# Altium project UNOshield.PrjPcb (part 1 of 2)
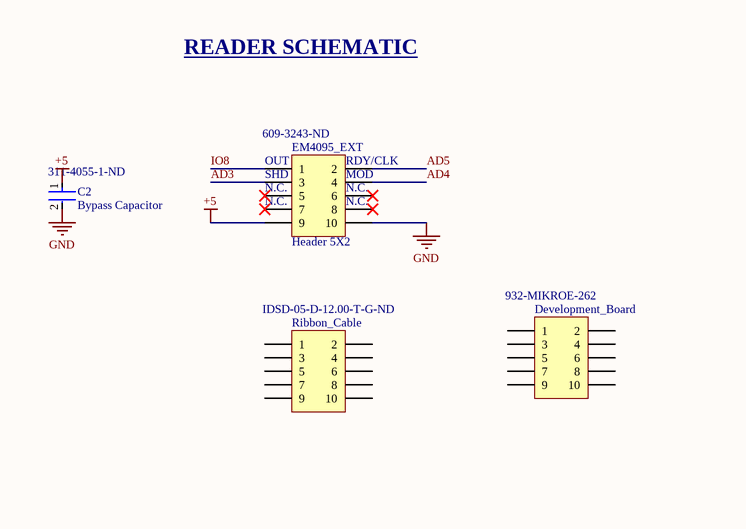
[diagram p0: EM4095.SchDoc, left]
6 sheets, 37 parts. Net scope: global (net labels, ports and power ports of the same name join across sheets).
Board files: UNOshield.PcbDoc, RFID_Panel.PcbDoc
Sheets:
  EM4095.SchDoc
  MAX490.SchDoc
  UNOshield.SchDoc
  Door_Actuator.SchDoc
  Buzzer.SchDoc
  LCD.SchDoc

## Sheet EM4095.SchDoc
size A

### Parts
C2  Bypass Capacitor  Supplier Part Number 1: 311-4055-1-ND  [FP-CC0603-DA-MFG]
Development_Board  Supplier Part Number 1: 932-MIKROE-262  [HDR2X5]  (mechanical)
EM4095_EXT  Header 5X2  Supplier Part Number 1: 609-3243-ND  [HDR2X5]
Ribbon_Cable  Supplier Part Number 1: IDSD-05-D-12.00-T-G-ND  [HDR2X5]  (mechanical)

### Nets
+5: C2.1 EM4095_EXT.9  [project net 5V]
GND: C2.2 EM4095_EXT.10
AD3: EM4095_EXT.3
AD4: EM4095_EXT.4
AD5: EM4095_EXT.2
IO8: EM4095_EXT.1

Not connected (* = marked no-connect by the designer): Development_Board 1 2 3 4 5 6 7 8 9 10; EM4095_EXT 5* 6* 7* 8*; Ribbon_Cable 1 2 3 4 5 6 7 8 9 10

### Notes on the sheet
- READER SCHEMATIC
- (near EM4095_EXT) OUT
- (near EM4095_EXT) SHD
- (near EM4095_EXT) RDY/CLK
- (near EM4095_EXT) MOD
- (near EM4095_EXT) N.C.

### Library data of the parts
C2 = CMP-03422-001228-1: CAP CER 0.1UF 10V X7R 0603; Manufacturer Part Number: CC0603KRX7R6BB104; Manufacturer: YAGEO; Material: Ceramic; Tolerance: 0.1; Capacitance: 100 nF; Temperature Coefficient: 15%; Value: 100 nF; Multilayer: Yes; Tolerance  (fill in as +-): 10%; Height: 0.9mm; RoHS: TRUE; Footprint Url: http://www.yageo.com/exep/pages/download/literatures/UPY-C_GEN_24.pdf; Octopart: https://octopart.com/cc0603krx7r6bb104-yageo-9291607; Device Class L1: Passive Components; Mouser Description: 0603 0.1 uF 10 V ±10 % Tolerance X7R SMT Multilayer Ceramic Capacitor; ComponentLink2URL: http://www.yageo.com/documents/recent/UPY-GPHC_X7R_6.3V-to-50V_18.pdf; Automotive: No; Voltage: 10 V; Device Class L3: Ceramic Capacitors; Category: Cap; Temperature: -55°C to +125°C; ComponentLink2Description: Datasheet; Voltage Rating: 10 V; Device Class L2: Capacitors; Lead Free: Yes; Temperature Range High: +125°C; Temperature Range Low: -55°C; Digikey Description: CAP CER 0.1UF 10V X7R 0603; Package: CC0603-DA; Temperature Characteristic: X7R; Supplier 1: Digikey; Stock 1: 58484; Pricing 1: 1=0.1, 10=0.055, 100=0.0327, 1000=0.02132 (USD); Mounting Technology: Surface Mount; Pins: 2; Dielectric Material: Ceramic; Package Shape: Rectangular; Case/Package: 0603; Terminal Finish: Nickel; Min Operating Temperature: -55°C; Max Operating Temperature: 125°C; JESD-609 Code: e3; Capacitor Type: Ceramic; Package Style: SMTMeter; Packaging: Tape and Reel; Tolerance (fill in as +-): 10%; Rated DC Voltage (URdc): 10V; Temperature Characteristics Code: X7R; Termination: Wraparound; Length: 1.6mm; Width: 0.8mm; Reach SVHC Compliant: Yes; RoHS Compliant: Yes; ComponentLink1URL: https://datasheet.ciiva.com:443/pdfs/VipMasterIC/IC/YAGO/YAGO-S-A0003557223/YAGO-S-A0003557223-1.pdf?src-supplier=IHS+Markit; ComponentLink1Description: https://datasheet.ciiva.com:443/pdfs/VipMasterIC/IC/YAGO/YAGO-S-A0003557223/YAGO-S-A0003557223-1.pdf?src-supplier=IHS+Markit; ComponentLink3URL: https://datasheet.ciiva.com/11586/upy-gphc-x7r-6-3v-to-50v-8-11586327.pdf?src-supplier=Avnet; ComponentLink3Description: https://datasheet.ciiva.com/11586/upy-gphc-x7r-6-3v-to-50v-8-11586327.pdf?src-supplier=Avnet
Development_Board = Header 5X2: EM4095 NFC/RFID Reader and Writer Development Board; Manufacturer: mikroElektronika; Manufacturer Part Number: MIKROE-262; Supplier 1: Mouser; RoHS: Yes; Category: Embedded Processors and Controllers; Stock 1: 16; Pricing 1: 1=29, 10=29, 50=29, 100=29, 1000=29, 10000=29 (USD); ComponentLink1URL: https://datasheet.ciiva.com/4712/rfid-manual-v100-31329-4712706.pdf?src-supplier=Mouser; ComponentLink1Description: https://datasheet.ciiva.com/4712/rfid-manual-v100-31329-4712706.pdf?src-supplier=Mouser; ComponentLink2URL: https://datasheet.ciiva.com/29616/rfid-manual-v100-29616555.pdf?src-supplier=Digikey; ComponentLink2Description: https://datasheet.ciiva.com/29616/rfid-manual-v100-29616555.pdf?src-supplier=Digikey
EM4095_EXT = Header 5X2: Board Connector, 66 Contact(s), 2 Row(s), Male, Straight, Solder Terminal; Manufacturer: Amphenol Communications Solutions; Manufacturer Part Number: 67997410HLF; LatestRevisionDate: 17-Jul-2002; LatestRevisionNote: Re-released for DXP Platform.; Publisher: Altium Limited; Supplier 1: Digikey; RoHS: No; Stock 1: 5769; Pricing 1: 1=0.3, 10=0.255, 400=0.19665, 800=0.18725, 1200=0.18197, 5200=0.16407, 10000=0.15667 (USD); ComponentLink1URL: https://datasheet.octopart.com/67997-410HLF-Amphenol-Communications-Solutions-datasheet-10288749.pdf?src-supplier=Farnell; ComponentLink1Description: https://datasheet.octopart.com/67997-410HLF-Amphenol-Communications-Solutions-datasheet-10288749.pdf?src-supplier=Farnell; ComponentLink2URL: https://datasheet.octopart.com/67997-410HLF-Areva-datasheet-15888151.pdf?src-supplier=Element14; ComponentLink2Description: https://datasheet.octopart.com/67997-410HLF-Areva-datasheet-15888151.pdf?src-supplier=Element14; ComponentLink3URL: https://datasheet.octopart.com/67997-410HLF-Amphenol-Communications-Solutions-datasheet-36854132.pdf?src-supplier=Electro+Sonic; ComponentLink3Description: https://datasheet.octopart.com/67997-410HLF-Amphenol-Communications-Solutions-datasheet-36854132.pdf?src-supplier=Electro+Sonic
Ribbon_Cable = Header 5X2: Cable Assembly, 28AWG; Manufacturer: Samtec; Manufacturer Part Number: IDSD-05-D-12.00-T-G; Supplier 1: Digikey; RoHS: Yes; Category: Cables and Wire; Stock 1: 125; Pricing 1: 1=6.19, 25=5.59, 50=5.2, 100=4.95, 500=4.05, 1000=3.75, 2500=3.6 (USD); Connector Support Type: CABLE ASSEMBLY; Reach SVHC Compliant: Yes; RoHS Compliant: Yes; ComponentLink1URL: https://datasheet.ciiva.com:443/pdfs/VipMasterIC/IC/SAMI/SAMI-S-A0008033238/SAMI-S-A0008033238-1.pdf?src-supplier=IHS+Markit; ComponentLink1Description: https://datasheet.ciiva.com:443/pdfs/VipMasterIC/IC/SAMI/SAMI-S-A0008033238/SAMI-S-A0008033238-1.pdf?src-supplier=IHS+Markit; ComponentLink2URL: ftp://ftp.samtec.com/webfiles/PDF/IDSS.PDF?src-supplier=Avnet; ComponentLink2Description: ftp://ftp.samtec.com/webfiles/PDF/IDSS.PDF?src-supplier=Avnet

## Sheet MAX490.SchDoc
size A
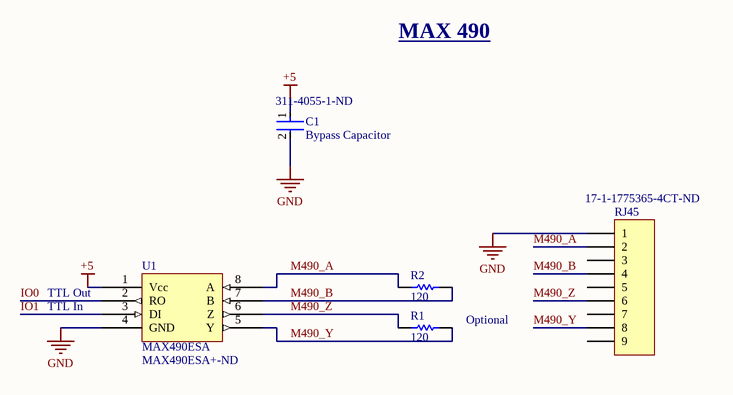
[diagram p1: MAX490.SchDoc]

### Parts
C1  Bypass Capacitor  Supplier Part Number 1: 311-4055-1-ND  [FP-CC0603-DA-MFG]
R1  Optional  value 120  [1608[0603]]
R2  value 120  [1608[0603]]
RJ45  Supplier Part Number 1: 17-1-1775365-4CT-ND  [1-1775365-4]
U1  MAX490ESA  Supplier Part Number 1: MAX490ESA+-ND  [SO-8_L]

### Nets
+5: C1.1 U1.1(Vcc)  [project net 5V]
GND: C1.2 RJ45.1 U1.4(GND)
IO0: U1.2(RO)
IO1: U1.3(DI)
M490_A: R2.2 RJ45.2 U1.8(A)
M490_B: R2.1 RJ45.4 U1.7(B)
M490_Y: R1.1 RJ45.8 U1.5(Y)
M490_Z: R1.2 RJ45.6 U1.6(Z)

Not connected (* = marked no-connect by the designer): RJ45 3 5 7 9

### Notes on the sheet
- MAX 490
- TTL In
- (near U1) TTL Out

### Library data of the parts
C1 = CMP-03422-001228-1: as C2 on sheet EM4095; Height: 0.9mm; RoHS: TRUE; Footprint Url: http://www.yageo.com/exep/pages/download/literatures/UPY-C_GEN_24.pdf; Octopart: https://octopart.com/cc0603krx7r6bb104-yageo-9291607; Device Class L1: Passive Components; Mouser Description: 0603 0.1 uF 10 V ±10 % Tolerance X7R SMT Multilayer Ceramic Capacitor; ComponentLink2URL: http://www.yageo.com/documents/recent/UPY-GPHC_X7R_6.3V-to-50V_18.pdf; Automotive: No; Voltage: 10 V; Device Class L3: Ceramic Capacitors; Category: Cap; Temperature: -55°C to +125°C; ComponentLink2Description: Datasheet; Voltage Rating: 10 V; Device Class L2: Capacitors; Lead Free: Yes; Temperature Range High: +125°C; Temperature Range Low: -55°C; Digikey Description: CAP CER 0.1UF 10V X7R 0603; Package: CC0603-DA; Temperature Characteristic: X7R; Supplier 1: Digikey; Stock 1: 58484; Pricing 1: 1=0.1, 10=0.055, 100=0.0327, 1000=0.02132 (USD); Mounting Technology: Surface Mount; Pins: 2; Dielectric Material: Ceramic; Package Shape: Rectangular; Case/Package: 0603; Terminal Finish: Nickel; Min Operating Temperature: -55°C; Max Operating Temperature: 125°C; JESD-609 Code: e3; Capacitor Type: Ceramic; Package Style: SMTMeter; Packaging: Tape and Reel; Tolerance (fill in as +-): 10%; Rated DC Voltage (URdc): 10V; Temperature Characteristics Code: X7R; Termination: Wraparound; Length: 1.6mm; Width: 0.8mm; Reach SVHC Compliant: Yes; RoHS Compliant: Yes; ComponentLink1URL: https://datasheet.ciiva.com:443/pdfs/VipMasterIC/IC/YAGO/YAGO-S-A0003557223/YAGO-S-A0003557223-1.pdf?src-supplier=IHS+Markit; ComponentLink1Description: https://datasheet.ciiva.com:443/pdfs/VipMasterIC/IC/YAGO/YAGO-S-A0003557223/YAGO-S-A0003557223-1.pdf?src-supplier=IHS+Markit; ComponentLink3URL: https://datasheet.ciiva.com/11586/upy-gphc-x7r-6-3v-to-50v-8-11586327.pdf?src-supplier=Avnet; ComponentLink3Description: https://datasheet.ciiva.com/11586/upy-gphc-x7r-6-3v-to-50v-8-11586327.pdf?src-supplier=Avnet
R1 R2 = Res1: SMD Chip Resistor, 120 Ohm, ± 5%, 250 mW, 0603 [1608 Metric], Thick Film, Anti-Surge; Manufacturer: Panasonic; Manufacturer Part Number: ERJ-PA3J121V; Supplier 1: Digikey; Supplier Part Number 1: P120BZCT-ND; RoHS: Yes; Category: Chip SMD Resistors; Stock 1: 57610; Pricing 1: 1=0.12, 10=0.056, 50=0.0358, 100=0.0301, 500=0.02112, 1000=0.01854 (USD); ComponentLink1URL: https://industrial.panasonic.com/cdbs/www-data/pdf/RDO0000/AOA0000C331.pdf?src-supplier=Digikey; ComponentLink1Description: https://industrial.panasonic.com/cdbs/www-data/pdf/RDO0000/AOA0000C331.pdf?src-supplier=Digikey; ComponentLink2URL: https://industrial.panasonic.com/ww/system/files/data/download/catalog/id_fixed-resistors_e_1.pdf?src-supplier=Digikey; ComponentLink2Description: https://industrial.panasonic.com/ww/system/files/data/download/catalog/id_fixed-resistors_e_1.pdf?src-supplier=Digikey; ComponentLink3URL: https://datasheet.octopart.com/ERJ-PA3J121V-Panasonic-datasheet-62096642.pdf?src-supplier=Future+Electronics; ComponentLink3Description: https://datasheet.octopart.com/ERJ-PA3J121V-Panasonic-datasheet-62096642.pdf?src-supplier=Future+Electronics
RJ45 = Header 9: Telecom and Datacom Connector; Manufacturer: TE Connectivity AMP; Manufacturer Series: 1775365; Supplier 1: Digikey; Manufacturer Part Number: 1-1775365-4; RoHS: Yes; Category: Modular / Ethernet Connectors; Stock 1: 551; Pricing 1: 1=3.81, 10=3.241, 25=3.0376, 50=2.8924 (USD); Contact Finish - Mating: NOT SPECIFIED; Connector Type: TELECOM AND DATACOM CONNECTOR; Reach SVHC Compliant: Yes; RoHS Compliant: Yes; ComponentLink1URL: https://www.te.com:443/usa-en/product-1-1775365-4.html?src-supplier=IHS+Markit; ComponentLink1Description: https://www.te.com:443/usa-en/product-1-1775365-4.html?src-supplier=IHS+Markit; ComponentLink2URL: https://datasheet.octopart.com/1-1775365-4-TE-Connectivity-datasheet-175421283.pdf?src-supplier=Farnell; ComponentLink2Description: https://datasheet.octopart.com/1-1775365-4-TE-Connectivity-datasheet-175421283.pdf?src-supplier=Farnell; ComponentLink3URL: https://www.te.com/commerce/DocumentDelivery/DDEController?Action=srchrtrv&amp;DocNm=1775365&amp;DocType=Customer+Drawing&amp;DocLang=English&src-supplier=Digikey; ComponentLink3Description: https://www.te.com/commerce/DocumentDelivery/DDEController?Action=srchrtrv&amp;DocNm=1775365&amp;DocType=Customer+Drawing&amp;DocLang=English&src-supplier=Digikey; ComponentLink4URL: http://www.te.com/commerce/DocumentDelivery/DDEController?Action=srchrtrv&DocNm=1775365&DocType=Customer+Drawing&DocLang=English&src-supplier=Digikey; ComponentLink4Description: http://www.te.com/commerce/DocumentDelivery/DDEController?Action=srchrtrv&DocNm=1775365&DocType=Customer+Drawing&DocLang=English&src-supplier=Digikey; ComponentLink5URL: https://datasheet.octopart.com/1-1775365-4-TE-Connectivity-datasheet-175421283.pdf?src-supplier=Element14; ComponentLink5Description: https://datasheet.octopart.com/1-1775365-4-TE-Connectivity-datasheet-175421283.pdf?src-supplier=Element14
U1 = MAX490ESA: Line Transceiver, 1 Func, 1 Driver, 1 Rcvr, CMOS, PDSO8; Manufacturer: Maxim; Manufacturer Part Number: MAX490ESA+; Package Body Material: Plastic; Output Polarity: Complementary; Differential Output: Yes; Driver Number of Bits: 1; High Level Input Current-Max: 2uA; Input Characteristics: DIFFERENTIAL SCHMITT TRIGGER; Out Swing-Min: 1.5V; Output Characteristics: TOTEM-POLE; Output Low Current-Max: 4mA; Package Equivalence Code: SOP8,.25; Power Supplies: 5V; Receive Delay-Max: 150ns; Max Supply Current: 500uA; Max Supply Voltage: 5.25V; Min Supply Voltage: 4.75V; Transmit Delay-Max: 60ns; Qualification Status: Not Qualified; Supplier 1: Digikey; RoHS: Yes; Category: RS-232 / RS-422 / RS-485 Interface ICs; Stock 1: 736; Pricing 1: 1=6.18, 10=4.743, 25=4.3836, 100=3.9887, 300=3.76847, 500=3.68704, 1000=3.59368, 2500=3.4951 (USD); Case/Package: SOP; Pins: 8; Package Shape: Rectangular; Terminal Finish: Tin; Min Operating Temperature: -40°C; Max Operating Temperature: 85°C; JESD-609 Code: e3; Interface IC Type: LINE TRANSCEIVER; JESD-30 Code: R-PDSO-G8; Moisture Sensitivity Level: 1; Channels: 1; Package Style: SMALL OUTLINEMeter; Peak Reflow Temperature (Cel): 260°C; Receiver Number of Bits: 1; Nominal Supply Voltage: 5V; Surface Mount: Yes; Technology: CMOS; Terminal Form: Gull Wing; Terminal Position: DUAL; Length: 4.9mm; Width: 3.9mm; Height - Seated (Max): 1.75mm; Terminal Pitch: 1.27mm; Temperature Grade: INDUSTRIAL; Reach SVHC Compliant: Yes; RoHS Compliant: Yes; ComponentLink1URL: https://datasheet.ciiva.com:443/pdfs/VipMasterIC/IC/MAXM/MAXMS13366/MAXMS13366-1.pdf?src-supplier=IHS+Markit; ComponentLink1Description: https://datasheet.ciiva.com:443/pdfs/VipMasterIC/IC/MAXM/MAXMS13366/MAXMS13366-1.pdf?src-supplier=IHS+Markit; ComponentLink2URL: https://datasheet.ciiva.com/4786/max1487-max491-96074-4786046.pdf?src-supplier=Mouser; ComponentLink2Description: https://datasheet.ciiva.com/4786/max1487-max491-96074-4786046.pdf?src-supplier=Mouser; ComponentLink3URL: https://datasheet.ciiva.com/1713/max1487-max491-1713335.pdf?src-supplier=Digikey; ComponentLink3Description: https://datasheet.ciiva.com/1713/max1487-max491-1713335.pdf?src-supplier=Digikey; ComponentLink4URL: https://datasheet.ciiva.com/3028/max1487-max491-3028673.pdf?src-supplier=Avnet; ComponentLink4Description: https://datasheet.ciiva.com/3028/max1487-max491-3028673.pdf?src-supplier=Avnet

## Sheet UNOshield.SchDoc
size A4; SPICEModelCacheCSOAAMCO: <root> / <DocumentId>CSOAAMCO</DocumentId> / </root>
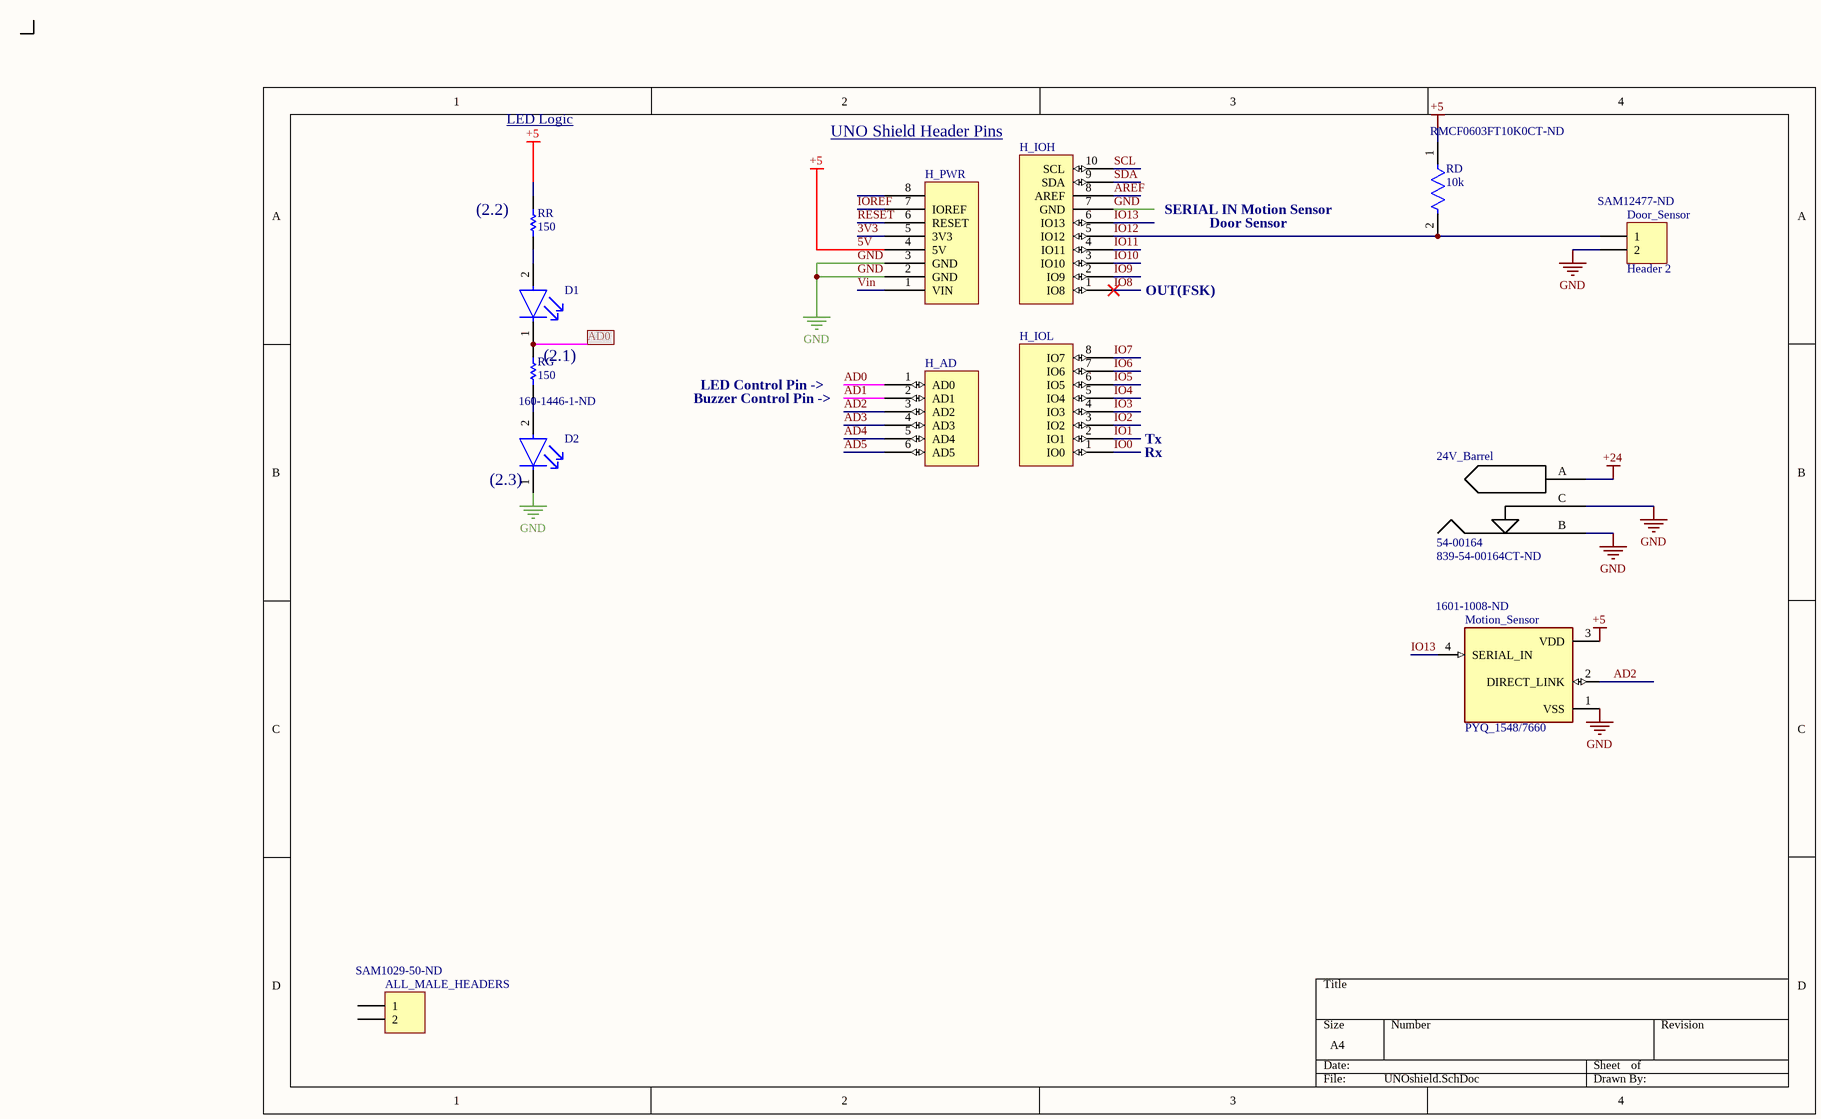
[diagram p2: UNOshield.SchDoc]

### Parts
24V_Barrel  54-00164  Supplier Part Number 1: 839-54-00164CT-ND  [54-00164]
ALL_MALE_HEADERS  Supplier Part Number 1: SAM1029-50-ND  [HDR1X2]  (mechanical)
D1  LS R976-NR-1  [FP-LS_R976-MFG]  (value not drawn)
D2  Supplier Part Number 1: 160-1446-1-ND  [FP-LTST-C191KGKT-MFG]  (hidden comment: LTST-C191KGKT)
Door_Sensor  Header 2  Supplier Part Number 1: SAM12477-ND  [HDR1X2]
H_AD  AD  [Header 6x1 8.5mm]  (value not drawn)
H_IOH  IOH  [Header 10x1 8.5mm]  (value not drawn)
H_IOL  IOL  [Header 8x1 8.5mm]  (value not drawn)
H_PWR  POWER_UNO  [Header 8x1 8.5mm]  (value not drawn)
Motion_Sensor  PYQ_1548/7660  Supplier Part Number 1: 1601-1008-ND  [TO254P940H440-4]
RD  10k  Supplier Part Number 1: RMCF0603FT10K0CT-ND  [FP-RC0603-0_55-IPC_C]
RG  value 150  [C0805]  (hidden comment: Res1)
RR  value 150  [C0805]  (hidden comment: Res1)

### Nets
5V: H_PWR.4(5V) Motion_Sensor.3(VDD) RD.1 RR.2  [also labelled +5]
+24: 24V_Barrel.A(Pin/Center)
GND: 24V_Barrel.B 24V_Barrel.C(Sheath/Outer) D2.1(C) Door_Sensor.2 H_IOH.7(GND) H_PWR.2(GND) H_PWR.3(GND) Motion_Sensor.1(VSS)
3V3: H_PWR.5(3V3)
AD0: D1.1(C) H_AD.1(AD0) RG.2
AD1: H_AD.2(AD1)
AD2: H_AD.3(AD2) Motion_Sensor.2(DIRECT_LINK)
AD3: H_AD.4(AD3)
AD4: H_AD.5(AD4)
AD5: H_AD.6(AD5)
AREF: H_IOH.8(AREF)
IO0: H_IOL.1(IO0)
IO1: H_IOL.2(IO1)
IO2: H_IOL.3(IO2)
IO3: H_IOL.4(IO3)
IO4: H_IOL.5(IO4)
IO5: H_IOL.6(IO5)
IO6: H_IOL.7(IO6)
IO7: H_IOL.8(IO7)
IO8: H_IOH.1(IO8)
IO9: H_IOH.2(IO9)
IO10: H_IOH.3(IO10)
IO11: H_IOH.4(IO11)
IO12: Door_Sensor.1 H_IOH.5(IO12) RD.2
IO13: H_IOH.6(IO13) Motion_Sensor.4(SERIAL_IN)
IOREF: H_PWR.7(IOREF)
RESET: H_PWR.6(RESET)
SCL: H_IOH.10(SCL)
SDA: H_IOH.9(SDA)
Vin: H_PWR.1(VIN)
NetD1_2: D1.2(A) RR.1
NetD2_2: D2.2(A) RG.1

Not connected (* = marked no-connect by the designer): ALL_MALE_HEADERS 1 2; H_PWR 8

### Notes on the sheet
- LED Logic
- UNO Shield Header Pins
- (near RR) (2.2)
- SERIAL IN Motion Sensor
- Door Sensor
- OUT(FSK)
- (near RG) (2.1)
- LED Control Pin ->
- Buzzer Control Pin ->
- Rx
- Tx
- (near D2) (2.3)

### Library data of the parts
24V_Barrel = 54-00164: Power Barrel Connector Jack 2.10mm ID (0.083"), 5.50mm OD (0.217") Surface Mount, Right Angle; Manufacturer: Tensility; Supplier 1: Digikey; Manufacturer Part Number: 54-00164; RoHS: No; Category: Connectors; Stock 1: 4776; Pricing 1: 1=0.86, 10=0.73, 25=0.684, 50=0.6514, 100=0.6202 (USD); ComponentLink1URL: http://www.tensility.com/pdffiles/54-00164.pdf?src-supplier=Digikey; ComponentLink1Description: http://www.tensility.com/pdffiles/54-00164.pdf?src-supplier=Digikey; ComponentLink2URL: https://datasheet.octopart.com/54-00164-Tensility-datasheet-189118339.pdf?src-supplier=Master+Electronics; ComponentLink2Description: https://datasheet.octopart.com/54-00164-Tensility-datasheet-189118339.pdf?src-supplier=Master+Electronics
ALL_MALE_HEADERS = Header 2: Board Connector, 50 Contact(s), 1 Row(s), Male, Straight, 0.1 inch Pitch, Solder Terminal, Black Insulator, Receptacle; Manufacturer: Samtec; Manufacturer Part Number: TSW-150-07-G-S; Option: General Purpose; Contact Pattern: RECTANGULAR; Contact Style: SQ PIN-SKT; Filter Feature: No; Number Of Connectors: 1; Number of Contacts: 50; Plating Thickness: 10uin; Reference Standard: UL; Reliability: COMMERCIAL; Supplier 1: Digikey; RoHS: Yes; Category: Connectors; Stock 1: 9225; Pricing 1: 1=2.96, 25=2.8564, 50=2.7206, 100=2.5281, 500=2.08774, 1000=1.74274, 2500=1.4559, 5000=1.18715 (USD); Mounting Technology: Board; Contact Material: Bronze; Contact Finish - Mating: GOLD (10); Contact Finish - Termination: Gold (Au) - with Nickel (Ni) barrier; Insulation Color: Black; Insulation Material: Glass; Connector Type: BOARD CONNECTOR; JESD-609 Code: e4; Body/Shell Style: RECEPTACLE; Contact Gender: Male; Mixed Contacts: No; Mounting Style: STRAIGHT; Number Of PCB Rows: 1; Number of Rows Loaded: 1; PCB Contact Pattern: RECTANGULAR; Termination: Solder; Body Breadth: 0.1inch; Body Depth: 0.1inch; Mating Contact Pitch: 0.1inch; Terminal Length: 0.1inch; Terminal Pitch: 2.54mm; Flammability Rating: UL94 V-0; DIN Conformance: No; IEC Conformance: No; MIL Conformance: No; Reach SVHC Compliant: Yes; RoHS Compliant: Yes; ComponentLink1URL: https://datasheet.ciiva.com:443/pdfs/VipMasterIC/IC/SAMI/SAMI-S-A0002522030/SAMI-S-A0002522030-1.pdf?src-supplier=IHS+Markit; ComponentLink1Description: https://datasheet.ciiva.com:443/pdfs/VipMasterIC/IC/SAMI/SAMI-S-A0002522030/SAMI-S-A0002522030-1.pdf?src-supplier=IHS+Markit; ComponentLink2URL: https://datasheet.ciiva.com/711/tsw-xxx-xx-xxx-x-xx-xxx-mkt-711590.pdf?src-supplier=Digikey; ComponentLink2Description: https://datasheet.ciiva.com/711/tsw-xxx-xx-xxx-x-xx-xxx-mkt-711590.pdf?src-supplier=Digikey; ComponentLink3URL: https://datasheet.ciiva.com/9712/htsw-th-9712215.pdf?src-supplier=Avnet; ComponentLink3Description: https://datasheet.ciiva.com/9712/htsw-th-9712215.pdf?src-supplier=Avnet
D1 = CMP-62016-000037-1: LED RED DIFFUSED 0805 SMD; Lens Size: 1.25mm; Number of LEDs: 1; Luminous Intensity: 180mcd; Dominant Wavelength: 633nm; Lens Style: Flat; Reverse Voltage: 12V; Lens Color: White; Forward Voltage: 2.5V; Forward Current: 25mA; Power Dissipation: 65W; Luminous Flux: 0.47lm; Test Current: 20mA; Viewing Angle: 160°; Length: 2mm; Number of Pins: 2; Lens Transparency: Diffused; Min Operating Temperature: -30°C; Case Code (Metric): 2012; Depth: 1.35mm; Color: Red; Illumination Color: Red; Max Operating Temperature: 85°C; Mount: Surface Mount; Case/Package: 0805; Height: 0.9mm; Package Quantity: 16000; Number of Elements: 1; Radiation Hardening: No; Case Code (Imperial): 0805; Packaging: Tape and Reel; Width: 1.25mm; Supplier 1: Digi-Key; Supplier Part Number 1: 475-LSR976-NR-1CT-ND
D2 = CMP-2000-05198-4: NexarPartId: 549907; Manufacturer: Vishay Lite-On; Forward Voltage: 2V; Viewing Angle: 130°; Lens Transparency: Clear; Power Rating: 75mW; Number of LEDs: 1; Luminous Intensity: 35mcd; Forward Current: 20mA; Dominant Wavelength: 571nm; Illumination Color: Green; Lens Color: Clear, Colorless; Reverse Voltage: 5V; Wavelength: 574nm; Description: Single Color LED, Ultra Bright Green, Water Clear, 1.1mm; Shape: Rectangular; Optoelectronic Device Type: SINGLE COLOR LED; Overall Height: 0.55mm; Number of Pins: 2; Packaging: Tape and Reel; Number of Elements: 1; Schedule B: 8541402000, 8541402000; Height: 550µm; Case/Package: 0603; Depth: 800µm; Max Operating Temperature: 85°C; RoHS: Compliant; Lens Style: Clear; Lead Free: Lead Free; Length: 1.6mm; Mount: Surface Mount; Test Current: 20mA; Width: 800µm; Case Code (Imperial): 0603; Min Operating Temperature: -55°C; Case Code (Metric): 1608; Radiation Hardening: No; Power Dissipation: 75mW; Color: Green; Supplier 1: Digikey; Manufacturer Part Number: LTST-C191KGKT; Stock 1: 1206866; Pricing 1: 1=0.15, 10=0.1, 100=0.0688, 500=0.05448, 1000=0.04972, 2000=0.04564, 5000=0.04116, 10000=0.03835, 15000=0.0369, 25000=0.03527, 35000=0.03429, 50000=0.03334, 125000=0.03124, 250000=0.02993 (USD); Mounting Technology: Surface Mount; Pins: 2; Color@wavelength: Green; Terminal Finish: Tin; JESD-609 Code: e3; Luminous Intensity-Nom: 35mcd; Channels: 1; Reverse Voltage-Max: 5V; Size: 1.1mm; Terminal Pitch: 1.5mm; Reach SVHC Compliant: Yes; RoHS Compliant: Yes; ComponentLink1URL: https://datasheet.ciiva.com:443/pdfs/VipMasterIC/IC/LITE/LITE-S-A0003156116/LITE-S-A0003156116-1.pdf?src-supplier=IHS+Markit; ComponentLink1Description: https://datasheet.ciiva.com:443/pdfs/VipMasterIC/IC/LITE/LITE-S-A0003156116/LITE-S-A0003156116-1.pdf?src-supplier=IHS+Markit; ComponentLink2URL: https://datasheet.ciiva.com/2109/ltst-c191kgkt-2109973.pdf?src-supplier=Digikey; ComponentLink2Description: https://datasheet.ciiva.com/2109/ltst-c191kgkt-2109973.pdf?src-supplier=Digikey
Door_Sensor = Header 2: Board Connector, 2 Contact(s), 1 Row(s), Female, Straight, 0.1 inch Pitch, Solder Terminal, Black Insulator, Socket; Manufacturer: Samtec; Manufacturer Part Number: CES-102-01-G-S; Option: General Purpose; Additional Feature: Low Profile; Contact Pattern: RECTANGULAR; Contact Resistance: 10mR; Contact Style: SQ PIN-SKT; Filter Feature: No; Insertion Force-Max: 2.224N; Mating Information: MULTIPLE MATING PARTS AVAILABLE; Number Of Connectors: 1; Polarization Key: POLARIZED HOUSING; Rated Current (Signal): 1A; Number of Contacts: 2; Withdrawl Force-Min: 1.112N; Body Breadth: 0.12inch; Body Depth: 0.2inch; Plating Thickness: 20uin; Reference Standard: UL; Reliability: COMMERCIAL; LatestRevisionDate: 17-Jul-2002; LatestRevisionNote: Re-released for DXP Platform.; Publisher: Altium Limited; Supplier 1: Digikey; RoHS: Yes; Category: Connectors; Stock 1: 5771; Pricing 1: 1=0.39, 10=0.329, 100=0.2797, 500=0.24966, 1000=0.23774, 5000=0.21221, 10000=0.20208 (USD); Mounting Technology: Board; Contact Finish - Mating: GOLD (30); Contact Finish - Termination: Gold (Au) - with Nickel (Ni) barrier; Insulation Color: Black; Insulation Material: Glass; Min Operating Temperature: -65°C; Max Operating Temperature: 125°C; Connector Type: BOARD CONNECTOR; JESD-609 Code: e4; Body/Shell Style: SOCKET; Contact Gender: Female; Mixed Contacts: No; Mounting Style: STRAIGHT; Number Of PCB Rows: 1; Number of Rows Loaded: 1; PCB Contact Pattern: RECTANGULAR; Termination: Solder; Body Length: 0.2inch; Mating Contact Pitch: 0.1inch; Terminal Length: 0.12inch; Terminal Pitch: 2.54mm; Flammability Rating: UL94 V-0; DIN Conformance: No; IEC Conformance: No; MIL Conformance: No; Reach SVHC Compliant: Yes; RoHS Compliant: Yes; ComponentLink1URL: https://datasheet.ciiva.com:443/pdfs/VipMasterIC/IC/SAMI/SAMI-S-A0000096262/SAMIS23449-1.pdf?src-supplier=IHS+Markit; ComponentLink1Description: https://datasheet.ciiva.com:443/pdfs/VipMasterIC/IC/SAMI/SAMI-S-A0000096262/SAMIS23449-1.pdf?src-supplier=IHS+Markit; ComponentLink2URL: http://www.farnell.com/datasheets/2045624.pdf?src-supplier=Farnell; ComponentLink2Description: http://www.farnell.com/datasheets/2045624.pdf?src-supplier=Farnell; ComponentLink3URL: http://suddendocs.samtec.com/prints/ces-1xx-xx-x-s-xx-mkt.pdf?src-supplier=Digikey; ComponentLink3Description: http://suddendocs.samtec.com/prints/ces-1xx-xx-x-s-xx-mkt.pdf?src-supplier=Digikey; ComponentLink4URL: http://www.samtec.com/documents/webfiles/pdf/CES.pdf?src-supplier=Avnet; ComponentLink4Description: http://www.samtec.com/documents/webfiles/pdf/CES.pdf?src-supplier=Avnet; ComponentLink5URL: https://datasheet.octopart.com/CES-102-01-G-S-Samtec-datasheet-62107104.pdf?src-supplier=Newark; ComponentLink5Description: https://datasheet.octopart.com/CES-102-01-G-S-Samtec-datasheet-62107104.pdf?src-supplier=Newark; ComponentLink6URL: https://datasheet.octopart.com/CES-102-01-G-S-Samtec-datasheet-130012063.pdf?src-supplier=Toby+Electronics; ComponentLink6Description: https://datasheet.octopart.com/CES-102-01-G-S-Samtec-datasheet-130012063.pdf?src-supplier=Toby+Electronics; ComponentLink7URL: https://datasheet.octopart.com/CES-102-01-G-S-Samtec-datasheet-151455179.pdf?src-supplier=Sager+Electronics; ComponentLink7Description: https://datasheet.octopart.com/CES-102-01-G-S-Samtec-datasheet-151455179.pdf?src-supplier=Sager+Electronics
Motion_Sensor = PYQ_1548/7660: Low Power Digipyro Motion Sens; Manufacturer: Excelitas; MF: Excelitas Technologies; MP: PYQ 1548/7660; Package: TO-5 Excelitas Technologies; Price: None; Availability: Unavailable; SnapEDA_Link: https://www.snapeda.com/parts/PYQ%201548/7660/Excelitas%20Technologies/view-part/4328334/?ref=snap; Value: *; Supplier 1: Digikey; Manufacturer Part Number: PYQ 1548/7660; RoHS: No; Stock 1: 7795; Pricing 1: 1=5.88 (USD); ComponentLink1URL: https://media.digikey.com/pdf/Data%20Sheets/Excelitas%20PDFs/PYQ_1548_7660_Apr17,2019_DS.pdf?src-supplier=Digikey; ComponentLink1Description: https://media.digikey.com/pdf/Data%20Sheets/Excelitas%20PDFs/PYQ_1548_7660_Apr17,2019_DS.pdf?src-supplier=Digikey
RD = CMP-2100-03664-2: RES 10K OHM 1% 1/10W 0603; Manufacturer: Stackpole Electronics; Manufacturer Part Number: RMCF0603FT10K0; Voltage Rating: 75V; Voltage Rating (DC): 50V; Resistance: 10kR; Power Rating: 100mW; Temperature Coefficient: 100ppm/°C; Description: Fixed Resistor, Metal Glaze/thick Film, 0.1W, 10000ohm, 75V, 1% +/-Tol, 100ppm/Cel, Surface Mount, 0603; Rated Temperature: 70°C; Value: 10kR; Temperature Coefficient (ppm/Cel): 100; Package Height: 0.45mm; Package Length: 1.55mm; Package Width: 0.8mm; Reference Standard: AEC-Q200; Depth: 0.8mm; Termination: SMD/SMT; Resistor Type: Thick Film; Series: RC; Construction: Rectangular; Features: Moisture Resistant; Packaging: Tape and Reel; Min Operating Temperature: -55°C; Number of Terminations: 2; Lead Pitch: 0.3mm; RoHS Compliant: Yes; Case/Package: 0603; Resistance Tolerance: 1%; Military Standard: Not; Weight: 7.1E-05oz; Number of Pins: 2; Tolerance: 1%; Length: 1.6mm; Case Code (Imperial): 0603; Lead Free: Lead Free; Width: 0.8mm; Max Power Dissipation: 100mW; Height: 0.45mm; Max Operating Temperature: 155°C; Case Code (Metric): 1608; Size Code: 0603; Supplier 1: Digikey; RoHS: Yes; Category: Chip SMD Resistors; Stock 1: 2923261; Pricing 1: 1=0.1, 10=0.02, 100=0.0091, 1000=0.0048, 2500=0.00386 (USD); Mounting Technology: Surface Mount; Pins: 2; Package Shape: Rectangular; Terminal Finish: Nickel; JESD-609 Code: e3; Power: 100mW; Technology: METAL GLAZE/THICK FILM; Working Voltage: 75V; Reach SVHC Compliant: Yes; ComponentLink1URL: https://datasheet.ciiva.com:443/pdfs/VipMasterIC/IC/SEIE/SEIE-S-A0009541969/SEIE-S-A0009541969-1.pdf?src-supplier=IHS+Markit; ComponentLink1Description: https://datasheet.ciiva.com:443/pdfs/VipMasterIC/IC/SEIE/SEIE-S-A0009541969/SEIE-S-A0009541969-1.pdf?src-supplier=IHS+Markit; ComponentLink2URL: http://components.arrow.com/part/dataview/43747082S6756917N1174?src-supplier=Arrow+Electronics; ComponentLink2Description: http://components.arrow.com/part/dataview/43747082S6756917N1174?src-supplier=Arrow+Electronics; ComponentLink3URL: https://www.seielect.com/catalog/SEI-RMCF_RMCP.pdf?src-supplier=Avnet; ComponentLink3Description: https://www.seielect.com/catalog/SEI-RMCF_RMCP.pdf?src-supplier=Avnet; ComponentLink4URL: https://www.seielect.com/catalog/sei-rmcf_rmcp.pdf?src-supplier=Digikey; ComponentLink4Description: https://www.seielect.com/catalog/sei-rmcf_rmcp.pdf?src-supplier=Digikey; ComponentLink5URL: http://www.seielect.com/catalog/sei-rmc.pdf?src-supplier=Future+Electronics; ComponentLink5Description: http://www.seielect.com/catalog/sei-rmc.pdf?src-supplier=Future+Electronics; ComponentLink6URL: https://datasheet.octopart.com/RMCF0603FT10K0-Stackpole-Electronics-datasheet-11547379.pdf?src-supplier=Future+Electronics; ComponentLink6Description: https://datasheet.octopart.com/RMCF0603FT10K0-Stackpole-Electronics-datasheet-11547379.pdf?src-supplier=Future+Electronics; ComponentLink7URL: https://www.verical.com/server-webapp/html/getDatasheet?partID=360913&src-supplier=Verical; ComponentLink7Description: https://www.verical.com/server-webapp/html/getDatasheet?partID=360913&src-supplier=Verical; ComponentLink8URL: https://datasheet.octopart.com/RMCF0603FT10K0-Stackpole-Electronics-datasheet-155966809.pdf?src-supplier=Electro+Sonic; ComponentLink8Description: https://datasheet.octopart.com/RMCF0603FT10K0-Stackpole-Electronics-datasheet-155966809.pdf?src-supplier=Electro+Sonic
RG RR = Res1: Fixed Resistor, Metal Glaze/thick Film, 0.125W, 150ohm, 150V, 1% +/-Tol, 100ppm/Cel, Surface Mount, 0805; Manufacturer: Yageo; Manufacturer Part Number: RC0805FR-07150RL; Additional Feature: LASER TRIMMABLE; Power: 125mW; Rated Temperature: 70°C; Temperature Coefficient (ppm/Cel): 100; Package Height: 0.5mm; Package Length: 2mm; Package Width: 1.25mm; Supplier 1: Digikey; Supplier Part Number 1: 311-150CRCT-ND; RoHS: Yes; Category: Chip SMD Resistors; Stock: 975966; Pricing: 1=0.1, 10=0.014, 100=0.0112, 1000=0.00918 (USD); Mounting Technology: Surface Mount; Pins: 2; Package Shape: Rectangular; Case/Package: 0805; Terminal Finish: Nickel; Min Operating Temperature: -55°C; Max Operating Temperature: 155°C; Tolerance: 1%; JESD-609 Code: e3; Resistor Type: FIXED RESISTOR; Construction: Chip; Packaging: Tape and Reel; Technology: METAL GLAZE/THICK FILM; Termination: Wraparound; Working Voltage: 150V; Reach SVHC Compliant: Yes; RoHS Compliant: Yes; ComponentLink1URL: https://datasheet.ciiva.com:443/pdfs/VipMasterIC/IC/YAGO/YAGO-S-A0008145938/YAGO-S-A0008145938-1.pdf?src-supplier=IHS+Markit; ComponentLink1Description: https://datasheet.ciiva.com:443/pdfs/VipMasterIC/IC/YAGO/YAGO-S-A0008145938/YAGO-S-A0008145938-1.pdf?src-supplier=IHS+Markit; ComponentLink2URL: https://datasheet.ciiva.com/11819/0900766b8106beab-11819782.pdf?src-supplier=Rs; ComponentLink2Description: https://datasheet.ciiva.com/11819/0900766b8106beab-11819782.pdf?src-supplier=Rs; ComponentLink3URL: https://datasheet.ciiva.com/2456/pyu-r-int-thick-7-2456999.pdf?src-supplier=Digikey; ComponentLink3Description: https://datasheet.ciiva.com/2456/pyu-r-int-thick-7-2456999.pdf?src-supplier=Digikey; ComponentLink4URL: https://datasheet.ciiva.com/2457/pyu-r-int-thick-7-2457000.pdf?src-supplier=Digikey; ComponentLink4Description: https://datasheet.ciiva.com/2457/pyu-r-int-thick-7-2457000.pdf?src-supplier=Digikey; ComponentLink5URL: https://datasheet.ciiva.com/2457/pyu-r-int-thick-7-2457001.pdf?src-supplier=Digikey; ComponentLink5Description: https://datasheet.ciiva.com/2457/pyu-r-int-thick-7-2457001.pdf?src-supplier=Digikey; ComponentLink6URL: https://datasheet.ciiva.com/7660/38627-7660798.pdf?src-supplier=Element14; ComponentLink6Description: https://datasheet.ciiva.com/7660/38627-7660798.pdf?src-supplier=Element14; ComponentLink7URL: https://datasheet.ciiva.com/46447/444164-46447566.pdf?src-supplier=Element14; ComponentLink7Description: https://datasheet.ciiva.com/46447/444164-46447566.pdf?src-supplier=Element14; ComponentLink8URL: https://datasheet.ciiva.com/12668/rc0805-12668251.pdf?src-supplier=Mouser; ComponentLink8Description: https://datasheet.ciiva.com/12668/rc0805-12668251.pdf?src-supplier=Mouser
H_AD = AD: Supplier 1: Arrow; Supplier Part Number 1: 2699089; Supplier 2: Digi-Key; Supplier Part Number 2: SAM1198-06-ND; Supplier 3: Arrow; Supplier Part Number 3: 2699088; Supplier 4: Arrow; Supplier Part Number 4: 2699075
H_IOH = IOH: Supplier 1: Arrow; Supplier Part Number 1: 2698803S4475693N1004; Supplier 2: Digi-Key; Supplier Part Number 2: SAM1198-10-ND; Supplier 3: Arrow; Supplier Part Number 3: 2698789
H_IOL = IOL: Supplier 1: Digi-Key; Supplier Part Number 1: SAM1198-08-ND; Supplier 2: Arrow; Supplier Part Number 2: 2698939; Supplier 3: Arrow; Supplier Part Number 3: 2698940; Supplier 4: Arrow; Supplier Part Number 4: 2698925
H_PWR = POWER_UNO: Supplier 1: Digi-Key; Supplier Part Number 1: SAM1198-08-ND; Supplier 2: Arrow; Supplier Part Number 2: 2698939; Supplier 3: Arrow; Supplier Part Number 3: 2698940; Supplier 4: Arrow; Supplier Part Number 4: 2698925

## Sheet Door_Actuator.SchDoc
size A
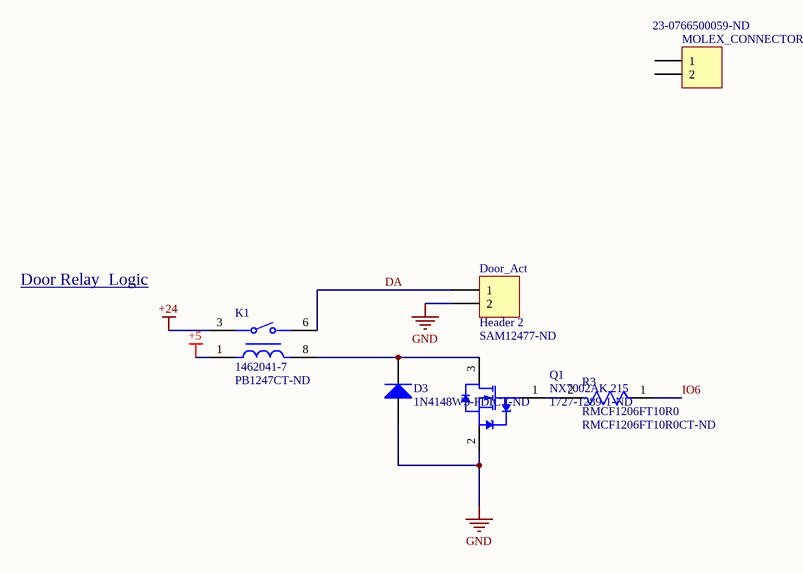
[diagram p3: Door_Actuator.SchDoc]

### Parts
D3  Supplier Part Number 1: 1N4148WS-FDICT-ND  [DIOD-SOD323-2-A_V]  (hidden comment: 1N4148WS-7-F)
Door_Act  Header 2  Supplier Part Number 1: SAM12477-ND  [HDR1X2]
K1  1462041-7  Supplier Part Number 1: PB1247CT-ND  [FP-1462041-7-MFG]
MOLEX_CONNECTOR  Supplier Part Number 1: 23-0766500059-ND  [HDR1X2]  (mechanical)
Q1  NX7002AK,215  Supplier Part Number 1: 1727-1289-1-ND  [NXP-SOT23_L]
R3  RMCF1206FT10R0  Supplier Part Number 1: RMCF1206FT10R0CT-ND  [FP-RMCF1206-IPC_C]

### Nets
+5: K1.1  [project net 5V]
+24: K1.3
GND: D3.1(A) Door_Act.2 Q1.2(S)
DA: Door_Act.1 K1.6
IO6: R3.1
NetD3_2: D3.2(K) K1.8 Q1.3(D)
NetQ1_1: Q1.1(G) R3.2

Not connected (* = marked no-connect by the designer): MOLEX_CONNECTOR 1 2

### Notes on the sheet
- Door Relay  Logic

### Library data of the parts
D3 = CMP-1667-00004-1: Fast Switching Diode, 75 V, 0.3 A, -65 to 150 degC, 2-Pin SOD323, RoHS, Tape and Reel; Manufacturer: Diodes; Diode Element Material: SILICON; Package Body Material: Plastic; Additional Feature: HIGH RELIABILITY; Diode Type: RECTIFIER; Forward Voltage: 715mV; Non-rep Pk Forward Current-Max: 2A; Number of Elements: 1; Max Output current: 150mA; Max Power Dissipation: 200mW; Rep Pk Reverse Voltage-Max: 75V; Reverse Recovery Time-Max: 0.004us; Time @ Peak Reflow Temperature-Max (s): 30s; Qualification Status: Not Qualified; DatasheetVersion: Rev. 25-2, 03/2016; PackageDescription: 2-Pin Small Outline Diode, Body 1.7 x 1.3 mm; ComponentLink2Description: Datasheet; ComponentLink1URL: http://www.diodes.com/; PackageReference: SOD323-2; ComponentLink2URL: http://www.diodes.com/datasheets/ds30097.pdf; ComponentLink1Description: Manufacturer URL; Supplier 1: Digikey; Manufacturer Part Number: 1N4148WS-7-F; RoHS: Yes; Category: Rectifier Diodes; Stock 1: 593066; Pricing 1: 1=0.1, 10=0.031, 3000=0.0202, 6000=0.017, 9000=0.0161, 15000=0.01599, 21000=0.01592, 30000=0.01585, 75000=0.01569, 150000=0.0156, 300000=0.01551 (USD); Pins: 2; Package Shape: Rectangular; Terminal Finish: Tin; Min Operating Temperature: -65°C; Max Operating Temperature: 150°C; JESD-609 Code: e3; JESD-30 Code: R-PDSO-G2; Moisture Sensitivity Level: 1; Package Style: SMALL OUTLINEMeter; Peak Reflow Temperature (Cel): 260°C; Surface Mount: Yes; Terminal Form: Gull Wing; Terminal Position: DUAL; Reach SVHC Compliant: Yes; RoHS Compliant: Yes; ComponentLink3URL: https://datasheet.ciiva.com:443/pdfs/VipMasterIC/IC/DIOD/DIOD-S-A0001754954/DIOD-S-A0001754954-1.pdf?src-supplier=IHS+Markit; ComponentLink3Description: https://datasheet.ciiva.com:443/pdfs/VipMasterIC/IC/DIOD/DIOD-S-A0001754954/DIOD-S-A0001754954-1.pdf?src-supplier=IHS+Markit; ComponentLink4URL: https://datasheet.ciiva.com/911/ds30097-911742.pdf?src-supplier=Digikey; ComponentLink4Description: https://datasheet.ciiva.com/911/ds30097-911742.pdf?src-supplier=Digikey; ComponentLink5URL: https://datasheet.ciiva.com/911/ds30097-911741.pdf?src-supplier=Digikey; ComponentLink5Description: https://datasheet.ciiva.com/911/ds30097-911741.pdf?src-supplier=Digikey; ComponentLink6URL: https://datasheet.ciiva.com/911/ds30097-911743.pdf?src-supplier=Digikey; ComponentLink6Description: https://datasheet.ciiva.com/911/ds30097-911743.pdf?src-supplier=Digikey; ComponentLink7URL: https://datasheet.ciiva.com/8300/ds30097-8300396.pdf?src-supplier=Avnet; ComponentLink7Description: https://datasheet.ciiva.com/8300/ds30097-8300396.pdf?src-supplier=Avnet; ComponentLink8URL: https://datasheet.ciiva.com/1179/ds30097-1179355.pdf?src-supplier=Element14; ComponentLink8Description: https://datasheet.ciiva.com/1179/ds30097-1179355.pdf?src-supplier=Element14
Door_Act = Header 2: as Door_Sensor on sheet UNOshield; Supplier 1: Digikey; RoHS: Yes; Category: Connectors; Stock 1: 5771; Pricing 1: 1=0.39, 10=0.329, 100=0.2797, 500=0.24966, 1000=0.23774, 5000=0.21221, 10000=0.20208 (USD); Mounting Technology: Board; Contact Finish - Mating: GOLD (30); Contact Finish - Termination: Gold (Au) - with Nickel (Ni) barrier; Insulation Color: Black; Insulation Material: Glass; Min Operating Temperature: -65°C; Max Operating Temperature: 125°C; Connector Type: BOARD CONNECTOR; JESD-609 Code: e4; Body/Shell Style: SOCKET; Contact Gender: Female; Mixed Contacts: No; Mounting Style: STRAIGHT; Number Of PCB Rows: 1; Number of Rows Loaded: 1; PCB Contact Pattern: RECTANGULAR; Termination: Solder; Body Length: 0.2inch; Mating Contact Pitch: 0.1inch; Terminal Length: 0.12inch; Terminal Pitch: 2.54mm; Flammability Rating: UL94 V-0; DIN Conformance: No; IEC Conformance: No; MIL Conformance: No; Reach SVHC Compliant: Yes; RoHS Compliant: Yes; ComponentLink1URL: https://datasheet.ciiva.com:443/pdfs/VipMasterIC/IC/SAMI/SAMI-S-A0000096262/SAMIS23449-1.pdf?src-supplier=IHS+Markit; ComponentLink1Description: https://datasheet.ciiva.com:443/pdfs/VipMasterIC/IC/SAMI/SAMI-S-A0000096262/SAMIS23449-1.pdf?src-supplier=IHS+Markit; ComponentLink2URL: http://www.farnell.com/datasheets/2045624.pdf?src-supplier=Farnell; ComponentLink2Description: http://www.farnell.com/datasheets/2045624.pdf?src-supplier=Farnell; ComponentLink3URL: http://suddendocs.samtec.com/prints/ces-1xx-xx-x-s-xx-mkt.pdf?src-supplier=Digikey; ComponentLink3Description: http://suddendocs.samtec.com/prints/ces-1xx-xx-x-s-xx-mkt.pdf?src-supplier=Digikey; ComponentLink4URL: http://www.samtec.com/documents/webfiles/pdf/CES.pdf?src-supplier=Avnet; ComponentLink4Description: http://www.samtec.com/documents/webfiles/pdf/CES.pdf?src-supplier=Avnet; ComponentLink5URL: https://datasheet.octopart.com/CES-102-01-G-S-Samtec-datasheet-62107104.pdf?src-supplier=Newark; ComponentLink5Description: https://datasheet.octopart.com/CES-102-01-G-S-Samtec-datasheet-62107104.pdf?src-supplier=Newark; ComponentLink6URL: https://datasheet.octopart.com/CES-102-01-G-S-Samtec-datasheet-130012063.pdf?src-supplier=Toby+Electronics; ComponentLink6Description: https://datasheet.octopart.com/CES-102-01-G-S-Samtec-datasheet-130012063.pdf?src-supplier=Toby+Electronics; ComponentLink7URL: https://datasheet.octopart.com/CES-102-01-G-S-Samtec-datasheet-151455179.pdf?src-supplier=Sager+Electronics; ComponentLink7Description: https://datasheet.octopart.com/CES-102-01-G-S-Samtec-datasheet-151455179.pdf?src-supplier=Sager+Electronics
K1 = CMP-03396-000009-1: RELAY TELECOM SPST 2A 5VDC; Manufacturer: TE Connectivity; Coil Power: 140mW; Standoff Height: 0.25mm; Number Of Contacts: 1; Switching Power: 60W; Coil Type: Non-Latching; Coil Resistance: 178Ω; Coil Voltage: 5V; Throw Configuration: SPST-NO; Coil Current(DC)-Max: 28mA; Coil/Input Supply Type: DC; Contact AC Max Rating R Load: 2A@250VAC; Contact Voltage(AC)-Max: 250V; Contact/Output Supply Type: AC; Relay Action: MOMENTARY; Relay Type: POWER/SIGNAL RELAY; Body Breadth: 6mm; Body Height: 5.71mm; Body Length or Diameter: 10mm; Reference Standard: UL; Sealing: RT5; Manufacturer Part Number: 1462041-7; Package: 1462041-7; Lead Free: Yes; Temperature Range Low: -40°C; Switching Current: 2A; Category: Relay; ComponentLink2Description: Datasheet; Height: 5.65mm; RoHS: TRUE; ComponentLink2URL: https://www.te.com/usa-en/product-1462041-7.html?te_bu=Cor&te_type=other&te_campaign=oct_glo_cor-oct-global-oth-prtnr-fy19-oct-octo-buy-bom_sma-298_2&elqCampaignId=35216; Device Class L1: Electromechanical; Ambient Temperature Range High: +85°C; Temperature Range High: +85°C; Temperature: -40°C to +85°C; Device Class L2: Relays; Device Class L3: Signal Relays; Octopart: https://octopart.com/1462041-7-te+connectivity-42558739; Automotive: No; Ambient Temperature Range Low: -40°C; Digikey Description: RELAY TELECOM SPST 2A 5VDC; Current Rating: 2A; Supplier 1: Digikey; Stock 1: 3163; Pricing 1: 1=5.56, 10=4.956, 25=4.7328, 50=4.5708, 100=4.414, 250=4.21484, 500=4.07006 (USD); Mounting Technology: Surface Mount; Max Operating Temperature: 85°C; Coil Voltage(DC)-Max: 5V; Contact Current(AC)-Max: 2A; Packaging: Tape and Reel; Relay Function: SPST; Termination: Solder; Reach SVHC Compliant: Yes; RoHS Compliant: Yes; ComponentLink1URL: https://datasheet.ciiva.com:443/pdfs/VipMasterIC/IC/TYEL/TYEL-S-A0008743874/TYEL-S-A0008772958-1.pdf?src-supplier=IHS+Markit; ComponentLink1Description: https://datasheet.ciiva.com:443/pdfs/VipMasterIC/IC/TYEL/TYEL-S-A0008743874/TYEL-S-A0008772958-1.pdf?src-supplier=IHS+Markit; ComponentLink3URL: https://datasheet.ciiva.com/46627/eng-cd-1462041-1-a4-1462041-1-46627997.pdf?src-supplier=Digikey; ComponentLink3Description: https://datasheet.ciiva.com/46627/eng-cd-1462041-1-a4-1462041-1-46627997.pdf?src-supplier=Digikey; ComponentLink4URL: https://datasheet.ciiva.com/15185/getdatasheetpartid-294850-15185995.pdf?src-supplier=Verical; ComponentLink4Description: https://datasheet.ciiva.com/15185/getdatasheetpartid-294850-15185995.pdf?src-supplier=Verical
MOLEX_CONNECTOR = Header 2: .093IN Pwr Connector Kit Single Row Panel Mnt Plug & Recept; 4 Ckt; Manufacturer: Molex; Manufacturer Part Number: 76650-0059; Connector Type: BOARD CONNECTOR; Option: General Purpose; Additional Feature: Low Profile; Body/Shell Style: SOCKET; Contact Pattern: RECTANGULAR; Contact Resistance: 10mR; Contact Style: SQ PIN-SKT; Filter Feature: No; Insertion Force-Max: 2.224N; Mating Information: MULTIPLE MATING PARTS AVAILABLE; Number Of Connectors: 1; Polarization Key: POLARIZED HOUSING; Rated Current (Signal): 1A; Number of Contacts: 2; Withdrawl Force-Min: 1.112N; Body Breadth: 0.12inch; Body Depth: 0.2inch; Mating Contact Pitch: 0.1inch; Plating Thickness: 20uin; Reference Standard: UL; Reliability: COMMERCIAL; Category: Connectors; Stock 1: 146; Pricing 1: 1=2.17, 10=1.884 (USD); Mounting Technology: Board; Contact Finish - Mating: GOLD (30); Contact Finish - Termination: Gold (Au) - with Nickel (Ni) barrier; Insulation Color: Black; Insulation Material: Glass; Min Operating Temperature: -65°C; Max Operating Temperature: 125°C; JESD-609 Code: e4; Contact Gender: Female; Mixed Contacts: No; Mounting Style: STRAIGHT; Number Of PCB Rows: 1; Number of Rows Loaded: 1; PCB Contact Pattern: RECTANGULAR; Termination: Solder; Body Length: 0.2inch; Terminal Length: 0.12inch; Terminal Pitch: 2.54mm; Flammability Rating: UL94 V-0; DIN Conformance: No; IEC Conformance: No; MIL Conformance: No; Reach SVHC Compliant: Yes; RoHS Compliant: Yes; Supplier 1: Digikey; RoHS: Yes; ComponentLink1URL: https://datasheet.ciiva.com/2094/76650-0059-2094686.pdf?src-supplier=Digikey; ComponentLink1Description: https://datasheet.ciiva.com/2094/76650-0059-2094686.pdf?src-supplier=Digikey; ComponentLink2URL: https://datasheet.ciiva.com/1090/525462-1090718.pdf?src-supplier=Element14; ComponentLink2Description: https://datasheet.ciiva.com/1090/525462-1090718.pdf?src-supplier=Element14; ComponentLink3URL: https://datasheet.ciiva.com/1090/76650-0059-1090822.pdf?src-supplier=Newark; ComponentLink3Description: https://datasheet.ciiva.com/1090/76650-0059-1090822.pdf?src-supplier=Newark; ComponentLink4URL: https://datasheet.ciiva.com/5170/datasheet2076650-0059-196700-5170205.pdf?src-supplier=Mouser; ComponentLink4Description: https://datasheet.ciiva.com/5170/datasheet2076650-0059-196700-5170205.pdf?src-supplier=Mouser; ComponentLink5URL: https://datasheet.ciiva.com/18451/70191308-18451020.pdf?src-supplier=Allied+Electronics; ComponentLink5Description: https://datasheet.ciiva.com/18451/70191308-18451020.pdf?src-supplier=Allied+Electronics
Q1 = CMP-1258-00137-1: Single N-Channel Trench MOSFET, 60 V, -55 to 150 degC, 3-Pin SOT23, Tape and Reel; Manufacturer: NXP Semiconductors; Packing: Tape & Reel; VGSth [typ] (V): 1.6; Coss [typ] (pF): 3.4; Channel Type: N; Ciss [typ] (pF): 11; VDS [max] (V): 60; Package Body Material: Plastic; Transistor Element Material: SILICON; Drain Current-Max (ID): 190mA; Drain-source On Resistance-Max: 5.2R; DS Breakdown Voltage-Min: 60V; FET Technology: METAL-OXIDE SEMICONDUCTOR; Number of Elements: 1; Operating Mode: ENHANCEMENT MODE; Transistor Application: SWITCHING; Reference Standard: IEC-60134; JEDEC-95 Code: TO-236AB; ComponentLink2Description: Datasheet; PackageDescription: 3-Pin Small Outline Transistor Package, Body 2.9 x 1.3 mm, Pitch 0.95 mm; Mounting Technology: Surface Mount; PackageVersion: 06-03-16, 03/2006; Code_JEDEC: TO-236AB; ComponentLink3Description: Package Specification; DatasheetVersion: Rev. 5; ComponentLink2URL: http://www.nxp.com/documents/data_sheet/NX7002AK.pdf; ComponentLink1URL: http://www.nxp.com/; ComponentLink1Description: Manufacturer URL; PackageReference: SOT23; PartNumber: NX7002AK,215; ComponentLink3URL: http://www.nxp.com/documents/outline_drawing/sot023_po.pdf; Supplier 1: Digikey; Manufacturer Part Number: NX7002AK,215; RoHS: Yes; Category: MOSFETs; Stock 1: 306595; Pricing 1: 1=0.13, 10=0.088, 100=0.0428, 500=0.04112, 1000=0.0363 (USD); Pins: 3; Package Shape: Rectangular; Terminal Finish: Tin; JESD-609 Code: e3; Polarity/Channel Type: N-CHANNEL; JESD-30 Code: R-PDSO-G3; Moisture Sensitivity Level: 1; Package Style: SMALL OUTLINEMeter; Surface Mount: Yes; Terminal Form: Gull Wing; Terminal Position: DUAL; Reach SVHC Compliant: Yes; RoHS Compliant: Yes; ComponentLink4URL: https://datasheet.ciiva.com:443/pdfs/VipMasterIC/IC/PHGL/PHGLS26009/PHGLS26012-1.pdf?src-supplier=IHS+Markit; ComponentLink4Description: https://datasheet.ciiva.com:443/pdfs/VipMasterIC/IC/PHGL/PHGLS26009/PHGLS26012-1.pdf?src-supplier=IHS+Markit; ComponentLink5URL: http://www.farnell.com/datasheets/1968065.pdf?src-supplier=Farnell; ComponentLink5Description: http://www.farnell.com/datasheets/1968065.pdf?src-supplier=Farnell; ComponentLink6URL: http://www.farnell.com/datasheets/1968065.pdf?src-supplier=Newark; ComponentLink6Description: http://www.farnell.com/datasheets/1968065.pdf?src-supplier=Newark
R3 = CMP-26527-000112-1: RES 10 OHM 1% 1/4W 1206; Manufacturer: Stackpole Electronics; Temperature Coefficient: 100ppm/°C; Resistance: 10R; Working Voltage: 200V; Max Power Dissipation: 250mW; Rated Temperature: 70°C; Value: 10R; Temperature Coefficient (ppm/Cel): 100; Package Height: 0.55mm; Package Length: 3.2mm; Package Width: 1.6mm; Reference Standard: AEC-Q200; Width: 0.063inch; Case/Package: 1206; Series: RMCF; Number of Terminations: 2; Case Code (Imperial): 1206; Contact Plating: Tin; Packaging: Tape and Reel; Lead Free: Lead Free; Depth: 1.6mm; Case Code (Metric): 3216; RoHS Compliant: Yes; Height: 0.028inch; Resistor Type: Thick Film; Tolerance: 1%; Military Standard: Not; Radiation Hardening: No; Mount: Surface Mount; Length: 3.2mm; Power Rating: 250mW; Min Operating Temperature: -55°C; Features: Automotive AEC-Q200; Construction: Rectangular; Max Operating Temperature: 155°C; Supplier 1: Digikey; Manufacturer Part Number: RMCF1206FT10R0; RoHS: Yes; Category: Chip SMD Resistors; Stock 1: 402347; Pricing 1: 1=0.1, 10=0.029, 100=0.0144, 1000=0.00806, 2500=0.00702 (USD); Mounting Technology: Surface Mount; Pins: 2; Package Shape: Rectangular; Terminal Finish: Nickel; JESD-609 Code: e3; Power: 250mW; Technology: METAL GLAZE/THICK FILM; Termination: Wraparound; Reach SVHC Compliant: Yes; ComponentLink1URL: https://datasheet.ciiva.com:443/pdfs/VipMasterIC/IC/SEIE/SEIE-S-A0009541969/SEIE-S-A0009541969-1.pdf?src-supplier=IHS+Markit; ComponentLink1Description: https://datasheet.ciiva.com:443/pdfs/VipMasterIC/IC/SEIE/SEIE-S-A0009541969/SEIE-S-A0009541969-1.pdf?src-supplier=IHS+Markit; ComponentLink2URL: https://datasheet.ciiva.com/15193/getdatasheetpartid-408274-15193660.pdf?src-supplier=Verical; ComponentLink2Description: https://datasheet.ciiva.com/15193/getdatasheetpartid-408274-15193660.pdf?src-supplier=Verical